# Altium schematic sheet E-17 MIPI DSI_MIPI CSI.SchDoc: FRDM-IMX93
size 513 x 386 mm; DrawnBy: FORLINX; Organization: ORGANIZATION; Address1: ADDRESS 1; Address2: ADDRESS 2; Address3: ADDRESS 3; Address4: ADDRESS 4; Revision: -; ENG_APP_DATE: --/--/--; DSN_APP_DATE: --/--/--; CHK_APP_DATE: --/--/--; Classification: Public, Company Internal/Proprietary, Company Confidential,  Company Secret; Page Create Date: March  8, 1995; OrgName: NXP Semiconductor; FIUO: A; OrgAddr1: NO. 192 Liangjing Rd. Pudong New Area, ShangHai; Page Number: 17; PageTitle: MIPI DSI/MIPI CSI; Page Size: C; Page Count: 23; Designer: FORLINX; RevCode: B1; Approver: NXP SE; Doc: SCH-94611 PDF: SPF-94611; DsnPath: T:\FILES\Designs\Single Board Computers\i.MX93-FRDM\Design Files\SCH-94611_B1.DSN; SchematicName: FRDM-i.MX 93 Development Board; PageName: E-17 MIPI DSI/MIPI CSI; PageSize: C; TopSchematic: True
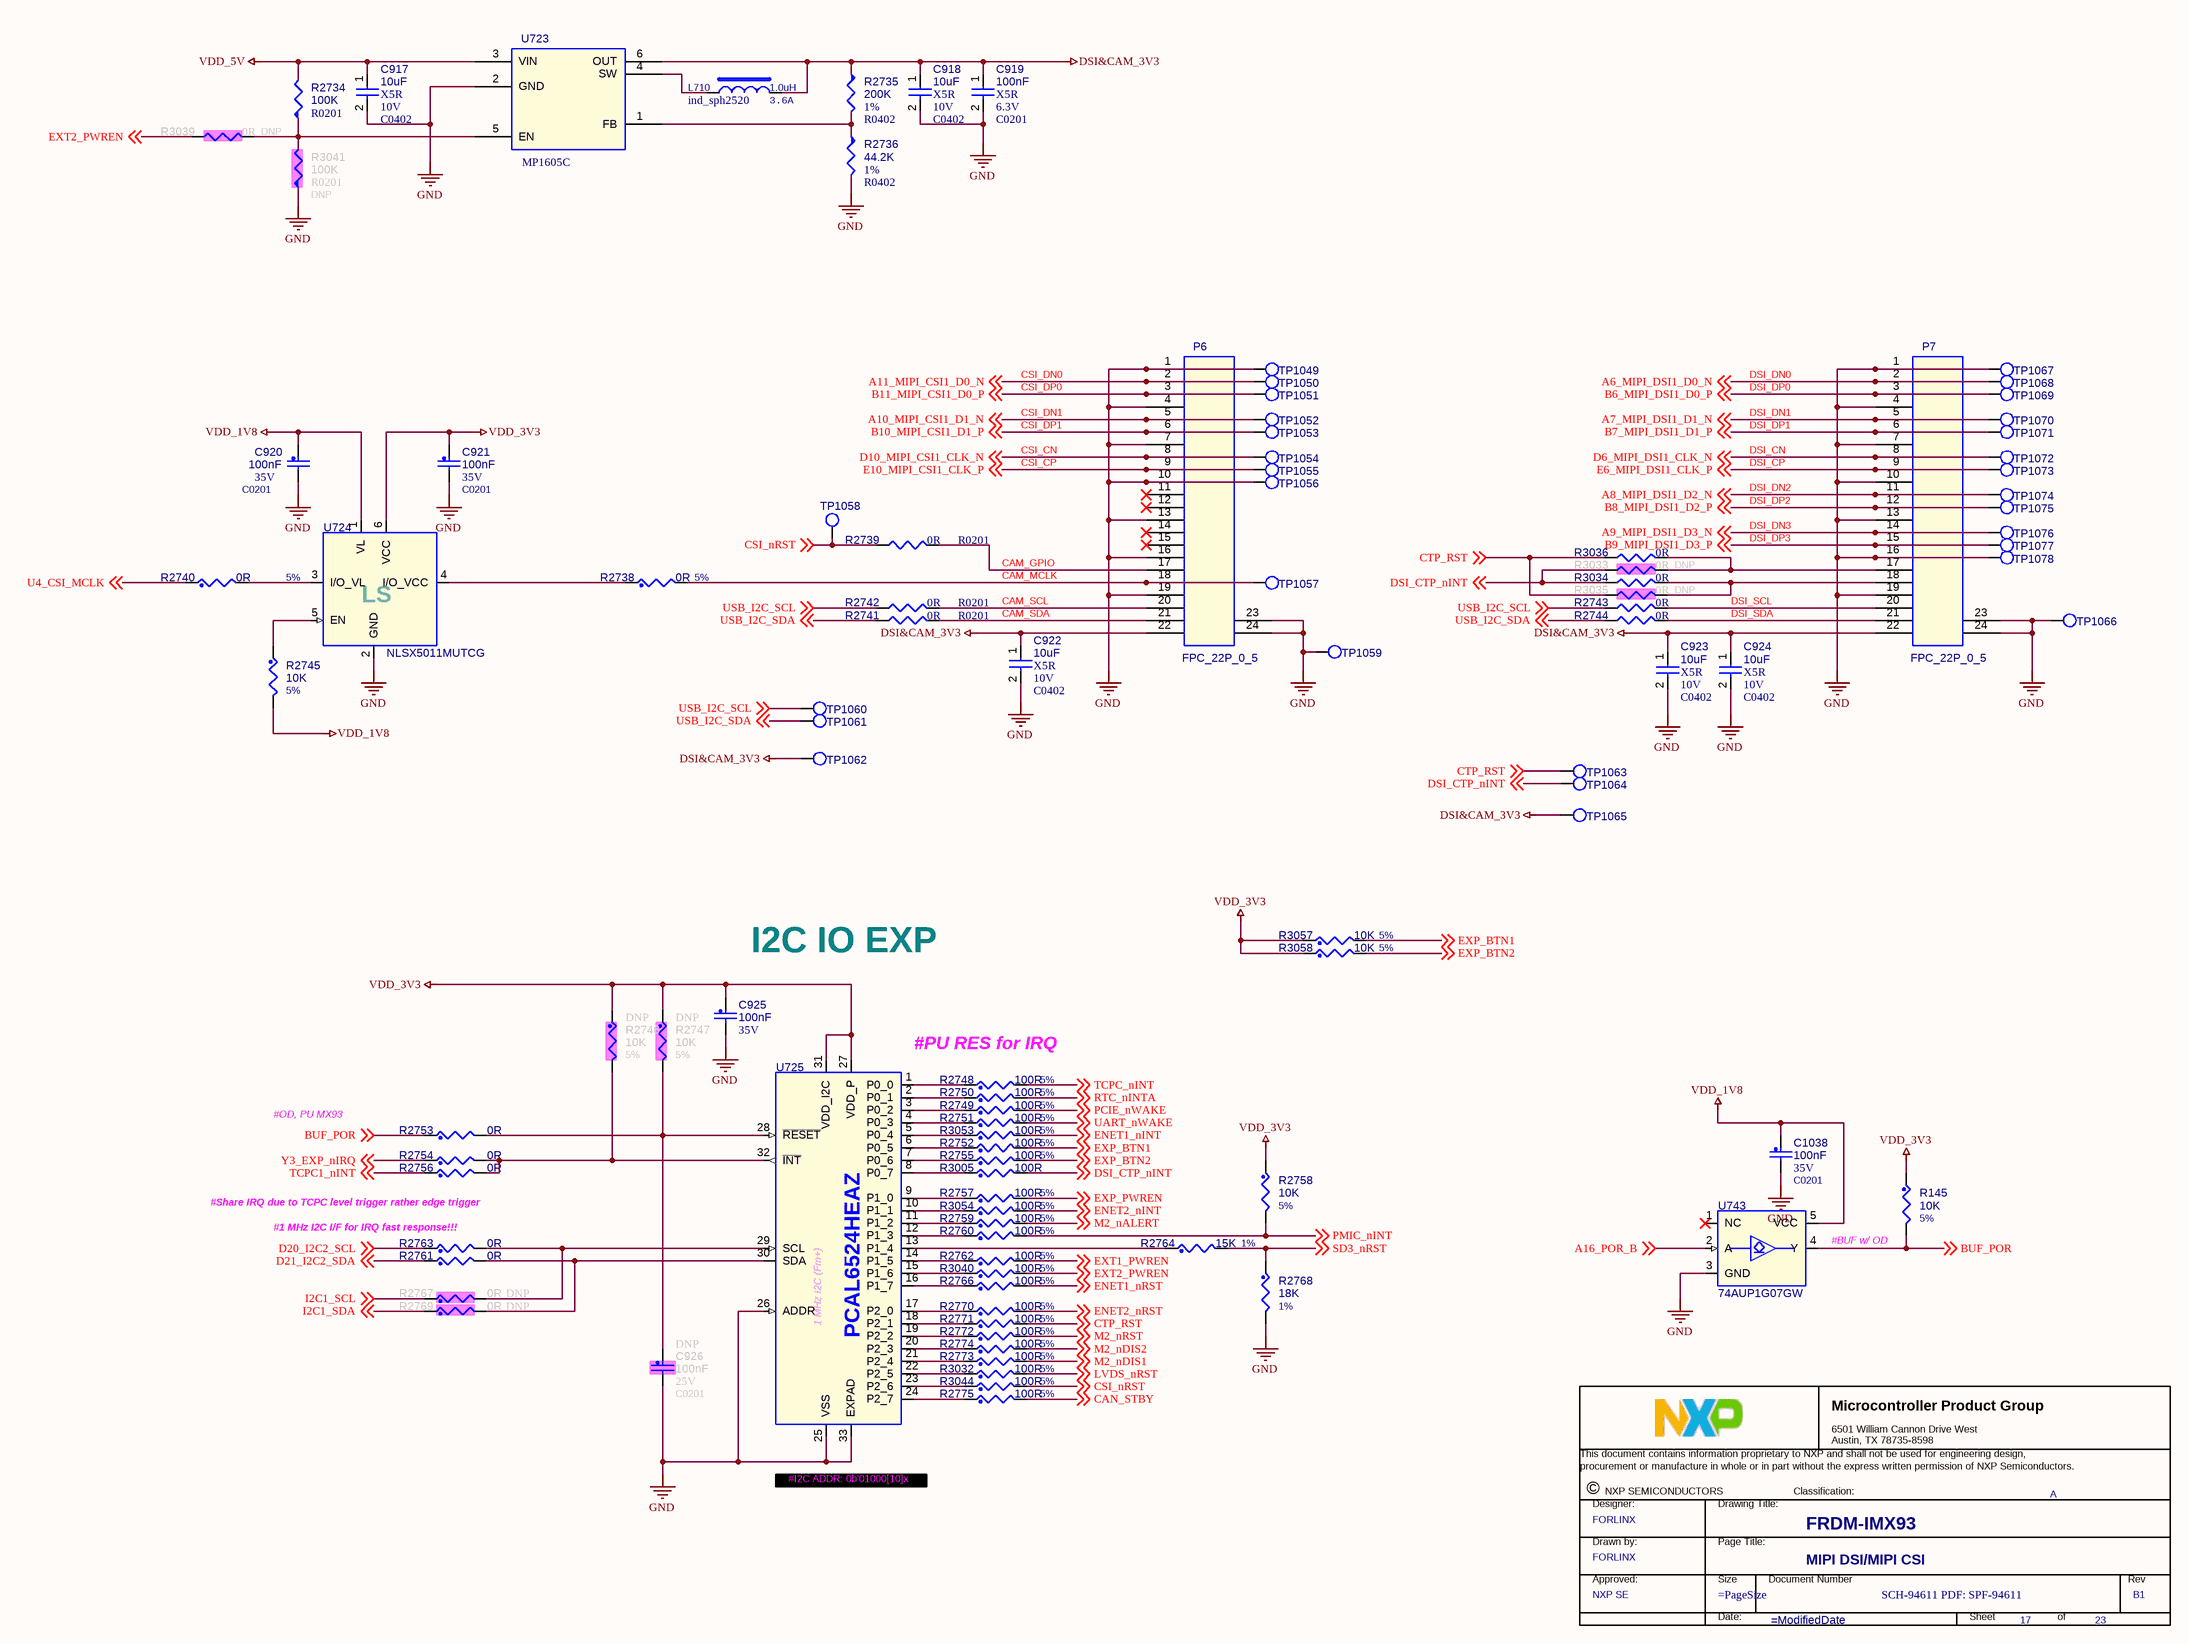
[diagram p0: E-17 MIPI DSI_MIPI CSI.SchDoc]

## Parts
*  Title: FRDM-IMX93  RevCode: B1  PageTitle: MIPI DSI/MIPI CSI  Page Number: 17  Page Count: 23  DrawnBy: FORLINX  Doc: SCH-94611 PDF: SPF-94611  Approver: NXP SE  FIUO: A  (graphical)
C917  10uF  Voltage: 10V  Dielectric: X5R  [C0402]
C918  10uF  Voltage: 10V  Dielectric: X5R  [C0402]
C919  100nF  Voltage: 6.3V  Dielectric: X5R  [C0201]
C920  100nF  VOLTAGE: 35V  [C0201]
C921  100nF  VOLTAGE: 35V  [C0201]
C922  10uF  Voltage: 10V  Dielectric: X5R  [C0402]
C923  10uF  Voltage: 10V  Dielectric: X5R  [C0402]
C924  10uF  Voltage: 10V  Dielectric: X5R  [C0402]
C925  100nF  VOLTAGE: 35V  [C0402]
C926  100nF  ASSY_OPT: DNP  VOLTAGE: 25V  [C0201]
C1038  100nF  VOLTAGE: 35V  [C0201]
L710  1.0uH  Isat: 3.6A  [ind_sph2520]
P6  FPC_22P_0_5  [fpc_22p_0_5]
P7  FPC_22P_0_5  [fpc_22p_0_5]
R145  10K  Tolerance: 5%  [R0201]
R2734  100K  [R0201]
R2735  200K  Tolerance: 1%  [R0402]
R2736  44.2K  Tolerance: 1%  [R0402]
R2738  0R  Tolerance: 5%  [R0201]
R2739  0R  [R0201]
R2740  0R  Tolerance: 5%  [R0201]
R2741  0R  [R0201]
R2742  0R  [R0201]
R2743  0R  [R0201]
R2744  0R  [R0201]
R2745  10K  Tolerance: 5%  [R0201]
R2746  10K  ASSY_OPT: DNP  Tolerance: 5%  [R0201]
R2747  10K  ASSY_OPT: DNP  Tolerance: 5%  [R0201]
R2748  100R  Tolerance: 5%  [R0201]
R2749  100R  Tolerance: 5%  [R0201]
R2750  100R  Tolerance: 5%  [R0201]
R2751  100R  Tolerance: 5%  [R0201]
R2752  100R  Tolerance: 5%  [R0201]
R2753  0R  [R0201]
R2754  0R  [R0201]
R2755  100R  Tolerance: 5%  [R0201]
R2756  0R  [R0201]
R2757  100R  Tolerance: 5%  [R0201]
R2758  10K  Tolerance: 5%  [R0201]
R2759  100R  Tolerance: 5%  [R0201]
R2760  100R  Tolerance: 5%  [R0201]
R2761  0R  [R0201]
R2762  100R  Tolerance: 5%  [R0201]
R2763  0R  [R0201]
R2764  15K  Tolerance: 1%  [R0402]
R2766  100R  Tolerance: 5%  [R0201]
R2767  0R  ASSY_OPT: DNP  [R0201]
R2768  18K  Tolerance: 1%  [R0402]
R2769  0R  ASSY_OPT: DNP  [R0201]
R2770  100R  Tolerance: 5%  [R0201]
R2771  100R  Tolerance: 5%  [R0201]
R2772  100R  Tolerance: 5%  [R0201]
R2773  100R  Tolerance: 5%  [R0201]
R2774  100R  Tolerance: 5%  [R0201]
R2775  100R  Tolerance: 5%  [R0201]
R3005  100R  [R0201]
R3032  100R  Tolerance: 5%  [R0201]
R3033  0R  ASSY_OPT: DNP  [R0201]
R3034  0R  [R0201]
R3035  0R  ASSY_OPT: DNP  [R0201]
R3036  0R  [R0201]
R3039  0R  ASSY_OPT: DNP  [R0201]
R3040  100R  Tolerance: 5%  [R0201]
R3041  100K  ASSY_OPT: DNP  [R0201]
R3044  100R  Tolerance: 5%  [R0201]
R3053  100R  Tolerance: 5%  [R0201]
R3054  100R  Tolerance: 5%  [R0201]
R3057  10K  Tolerance: 5%  [R0201]
R3058  10K  Tolerance: 5%  [R0201]
TP1049  TPAD_020  [tpad_020]  (value not drawn)
TP1050  TPAD_020  [tpad_020]  (value not drawn)
TP1051  TPAD_020  [tpad_020]  (value not drawn)
TP1052  TPAD_020  [tpad_020]  (value not drawn)
TP1053  TPAD_020  [tpad_020]  (value not drawn)
TP1054  TPAD_020  [tpad_020]  (value not drawn)
TP1055  TPAD_020  [tpad_020]  (value not drawn)
TP1056  TPAD_020  [tpad_020]  (value not drawn)
TP1057  TPAD_020  [tpad_020]  (value not drawn)
TP1058  TPAD_020  [tpad_020]  (value not drawn)
TP1059  TPAD_020  [tpad_020]  (value not drawn)
TP1060  TPAD_020  [tpad_020]  (value not drawn)
TP1061  TPAD_020  [tpad_020]  (value not drawn)
TP1062  TPAD_020  [tpad_020]  (value not drawn)
TP1063  TPAD_020  [tpad_020]  (value not drawn)
TP1064  TPAD_020  [tpad_020]  (value not drawn)
TP1065  TPAD_020  [tpad_020]  (value not drawn)
TP1066  TPAD_020  [tpad_020]  (value not drawn)
TP1067  TPAD_020  [tpad_020]  (value not drawn)
TP1068  TPAD_020  [tpad_020]  (value not drawn)
TP1069  TPAD_020  [tpad_020]  (value not drawn)
TP1070  TPAD_020  [tpad_020]  (value not drawn)
TP1071  TPAD_020  [tpad_020]  (value not drawn)
TP1072  TPAD_020  [tpad_020]  (value not drawn)
TP1073  TPAD_020  [tpad_020]  (value not drawn)
TP1074  TPAD_020  [tpad_020]  (value not drawn)
TP1075  TPAD_020  [tpad_020]  (value not drawn)
TP1076  TPAD_020  [tpad_020]  (value not drawn)
TP1077  TPAD_020  [tpad_020]  (value not drawn)
TP1078  TPAD_020  [tpad_020]  (value not drawn)
U723  MP1605C  [SOT563]
U724  NLSX5011MUTCG  [udfn6_0p4_1p2x1]
U725  PCAL6524HEAZ  [uqfn32_0p5_5x5_ep3x3]
U743  74AUP1G07GW  [sc70-5]

## Nets
DSI&CAM_3V3: C918.1 C919.1 C922.1 C923.1 C924.1 L710.2 P6.22 P7.22 R2735.1 TP1062.1(TP) TP1065.1(TP) U723.6(OUT)
GND: C917.2 C918.2 C919.2 C920.2 C921.2 C922.2 C923.2 C924.2 C925.2 C926.2 C1038.2 P6.1 P6.4 P6.7 P6.10 P6.13 P6.16 P6.19 P6.23 P6.24 P7.1 P7.4 P7.7 P7.10 P7.13 P7.16 P7.19 P7.23 P7.24 R2736.2 R2768.2 R3041.1 TP1049.1(TP) TP1056.1(TP) TP1059.1(TP) TP1066.1(TP) TP1067.1(TP) TP1078.1(TP) U723.2(GND) U724.2(GND) U725.25(VSS) U725.26(ADDR) U725.33(EXPAD) U743.3(GND)
VDD_1V8: C920.1 C1038.1 R2745.2 U724.1(VL) U743.5(VCC)
VDD_3V3: C921.1 C925.1 R145.1 R2746.1 R2747.1 R2758.1 R3057.1 R3058.1 U724.6(VCC) U725.27(VDD_P) U725.31(VDD_I2C)
VDD_5V: C917.1 R2734.2 U723.3(VIN)
A16_POR_B: U743.2(A) ; off-sheet A16_POR_B
BUF_POR: R145.2 R2753.1 U743.4(Y) ; off-sheet BUF_POR
CAM_GPIO: P6.17 R2739.2
CAM_MCLK: P6.18 R2738.2 TP1057.1(TP)
CAM_SCL: P6.20 R2742.2
CAM_SDA: P6.21 R2741.2
CAN_STBY: R2775.2 ; off-sheet CAN_STBY
CSI_CN: P6.8 TP1054.1(TP) ; off-sheet D10_MIPI_CSI1_CLK_N  [also labelled D10_MIPI_CSI1_CLK_N]
CSI_CP: P6.9 TP1055.1(TP) ; off-sheet E10_MIPI_CSI1_CLK_P  [also labelled E10_MIPI_CSI1_CLK_P]
CSI_DN0: P6.2 TP1050.1(TP) ; off-sheet A11_MIPI_CSI1_D0_N  [also labelled A11_MIPI_CSI1_D0_N]
CSI_DN1: P6.5 TP1052.1(TP) ; off-sheet A10_MIPI_CSI1_D1_N  [also labelled A10_MIPI_CSI1_D1_N]
CSI_DP0: P6.3 TP1051.1(TP) ; off-sheet B11_MIPI_CSI1_D0_P  [also labelled B11_MIPI_CSI1_D0_P]
CSI_DP1: P6.6 TP1053.1(TP) ; off-sheet B10_MIPI_CSI1_D1_P  [also labelled B10_MIPI_CSI1_D1_P]
CSI_nRST: R2739.1 R3044.2 TP1058.1(TP) ; off-sheet CSI_nRST
CTP_RST: R2771.2 R3035.1 R3036.1 TP1063.1(TP) ; off-sheet CTP_RST
D20_I2C2_SCL: R2763.1 ; off-sheet D20_I2C2_SCL
D21_I2C2_SDA: R2761.1 ; off-sheet D21_I2C2_SDA
DSI_CN: P7.8 TP1072.1(TP) ; off-sheet D6_MIPI_DSI1_CLK_N  [also labelled D6_MIPI_DSI1_CLK_N]
DSI_CP: P7.9 TP1073.1(TP) ; off-sheet E6_MIPI_DSI1_CLK_P  [also labelled E6_MIPI_DSI1_CLK_P]
DSI_CTP_nINT: R3005.2 R3033.1 R3034.1 TP1064.1(TP) ; off-sheet DSI_CTP_nINT
DSI_DN0: P7.2 TP1068.1(TP) ; off-sheet A6_MIPI_DSI1_D0_N  [also labelled A6_MIPI_DSI1_D0_N]
DSI_DN1: P7.5 TP1070.1(TP) ; off-sheet A7_MIPI_DSI1_D1_N  [also labelled A7_MIPI_DSI1_D1_N]
DSI_DN2: P7.11 TP1074.1(TP) ; off-sheet A8_MIPI_DSI1_D2_N  [also labelled A8_MIPI_DSI1_D2_N]
DSI_DN3: P7.14 TP1076.1(TP) ; off-sheet A9_MIPI_DSI1_D3_N  [also labelled A9_MIPI_DSI1_D3_N]
DSI_DP0: P7.3 TP1069.1(TP) ; off-sheet B6_MIPI_DSI1_D0_P  [also labelled B6_MIPI_DSI1_D0_P]
DSI_DP1: P7.6 TP1071.1(TP) ; off-sheet B7_MIPI_DSI1_D1_P  [also labelled B7_MIPI_DSI1_D1_P]
DSI_DP2: P7.12 TP1075.1(TP) ; off-sheet B8_MIPI_DSI1_D2_P  [also labelled B8_MIPI_DSI1_D2_P]
DSI_DP3: P7.15 TP1077.1(TP) ; off-sheet B9_MIPI_DSI1_D3_P  [also labelled B9_MIPI_DSI1_D3_P]
DSI_SCL: P7.20 R2743.2
DSI_SDA: P7.21 R2744.2
ENET1_nINT: R3053.2 ; off-sheet ENET1_nINT
ENET1_nRST: R2766.2 ; off-sheet ENET1_nRST
ENET2_nINT: R3054.2 ; off-sheet ENET2_nINT
ENET2_nRST: R2770.2 ; off-sheet ENET2_nRST
EXP_BTN1: R2752.2 R3057.2 ; off-sheet EXP_BTN1
EXP_BTN2: R2755.2 R3058.2 ; off-sheet EXP_BTN2
EXP_PWREN: R2757.2 ; off-sheet EXP_PWREN
EXT1_PWREN: R2762.2 ; off-sheet EXT1_PWREN
EXT2_PWREN: R3039.1 R3040.2 ; off-sheet EXT2_PWREN
I2C1_SCL: R2767.1 ; off-sheet I2C1_SCL
I2C1_SDA: R2769.1 ; off-sheet I2C1_SDA
LVDS_nRST: R3032.2 ; off-sheet LVDS_nRST
M2_nALERT: R2759.2 ; off-sheet M2_nALERT
M2_nDIS1: R2773.2 ; off-sheet M2_nDIS1
M2_nDIS2: R2774.2 ; off-sheet M2_nDIS2
M2_nRST: R2772.2 ; off-sheet M2_nRST
PCIE_nWAKE: R2749.2 ; off-sheet PCIE_nWAKE
PMIC_nINT: R2758.2 R2760.2 ; off-sheet PMIC_nINT
RTC_nINTA: R2750.2 ; off-sheet RTC_nINTA
SD3_nRST: R2764.2 R2768.1 ; off-sheet SD3_nRST
TCPC1_nINT: R2756.1 ; off-sheet TCPC1_nINT
TCPC_nINT: R2748.2 ; off-sheet TCPC_nINT
U4_CSI_MCLK: R2740.1 ; off-sheet U4_CSI_MCLK
UART_nWAKE: R2751.2 ; off-sheet UART_nWAKE
USB_I2C_SCL: R2742.1 R2743.1 TP1060.1(TP) ; off-sheet USB_I2C_SCL
USB_I2C_SDA: R2741.1 R2744.1 TP1061.1(TP) ; off-sheet USB_I2C_SDA
Y3_EXP_nIRQ: R2754.1 ; off-sheet Y3_EXP_nIRQ
NetC926_1: C926.1 R2747.2 R2753.2 U725.28(~{RESET})
NetL710_1: L710.1 U723.4(SW)
NetP7_17: P7.17 R3033.2 R3036.2
NetP7_18: P7.18 R3034.2 R3035.2
NetR2734_1: R2734.1 R3039.2 R3041.2 U723.5(EN)
NetR2735_2: R2735.2 R2736.1 U723.1(FB)
NetR2738_1: R2738.1 U724.4(I/O_VCC)
NetR2740_2: R2740.2 U724.3(I/O_VL)
NetR2745_1: R2745.1 U724.5(EN)
NetR2746_2: R2746.2 R2754.2 R2756.2 U725.32(~{INT})
NetR2748_1: R2748.1 U725.1(P0_0)
NetR2749_1: R2749.1 U725.3(P0_2)
NetR2750_1: R2750.1 U725.2(P0_1)
NetR2751_1: R2751.1 U725.4(P0_3)
NetR2752_1: R2752.1 U725.6(P0_5)
NetR2755_1: R2755.1 U725.7(P0_6)
NetR2757_1: R2757.1 U725.9(P1_0)
NetR2759_1: R2759.1 U725.11(P1_2)
NetR2760_1: R2760.1 U725.12(P1_3)
NetR2761_2: R2761.2 R2769.2 U725.30(SDA)
NetR2762_1: R2762.1 U725.14(P1_5)
NetR2763_2: R2763.2 R2767.2 U725.29(SCL)
NetR2764_1: R2764.1 U725.13(P1_4)
NetR2766_1: R2766.1 U725.16(P1_7)
NetR2770_1: R2770.1 U725.17(P2_0)
NetR2771_1: R2771.1 U725.18(P2_1)
NetR2772_1: R2772.1 U725.19(P2_2)
NetR2773_1: R2773.1 U725.21(P2_4)
NetR2774_1: R2774.1 U725.20(P2_3)
NetR2775_1: R2775.1 U725.24(P2_7)
NetR3005_1: R3005.1 U725.8(P0_7)
NetR3032_1: R3032.1 U725.22(P2_5)
NetR3040_1: R3040.1 U725.15(P1_6)
NetR3044_1: R3044.1 U725.23(P2_6)
NetR3053_1: R3053.1 U725.5(P0_4)
NetR3054_1: R3054.1 U725.10(P1_1)

Not connected (* = marked no-connect by the designer): P6 11* 12* 14* 15*; U743 1(NC)*

## Notes on the sheet
- (near U724) LS
- I2C IO EXP
- #PU RES for IRQ
- #OD, PU MX93
- #Share IRQ due to TCPC level trigger rather edge trigger
- (near R2763) #1 MHz I2C I/F for IRQ fast response!!!
- #BUF w/ OD
- (near U725) 1 MHz I2C (Fm+)
- #I2C ADDR: 0b'01000[10]x
- DWG. NO.
- REV.
- SHT.
- REVISION
- DESCRIPTION
- DATE
- APPROVED
- ENG:
- APPROVALS
- quilter.ai <http://quilter.ai>
- DSN:
- CHK:
- REFERENCE DOCUMENTS
- TITLE
- PROJECT
- BOM:
- FAB DWG:
- PCB DWG:
- ASSY DWG:
- SIZE
- FILE NAME
- C
- DWG NO.
- SHEET
- OF
- REV
- (in symbol TitleBlock_MCPG) Microcontroller Product Group; 6501 William Cannon Drive West / Austin, TX 78735-8598; This document contains information proprietary to NXP and shall not be used for engineering design,; procurement or manufacture in whole or in part without the express written permission of NXP Semiconductors.; ©; NXP SEMICONDUCTORS; Classification:; Designer:; Drawing Title:; Drawn by:; Page Title:; Approved:; Size; Document Number; Rev; Date:; Sheet; of

## Library data of the parts
* = TitleBlock_MCPG: Classification: Public, Company Internal/Proprietary, Company Confidential,  Company Secret; OrgAddr1: NO. 192 Liangjing Rd. Pudong New Area, ShangHai; OrgName: NXP Semiconductor; Page Size: =PageSize; Page Create Date: March  8, 1995; Designer: FORLINX; Page Modify Date: =ModifiedDate
C917 = CAP NP: 0402,10uF,6.3V,+/-20%,X5R; Part Reference: C917; Manufacturer: murata; Manufacturer PN: GRM188R61A106MAAL; MFG_PN01: 0402X106M6R3NT; RK PN: 902003487; Priority: A; Tolerance: ¡À20%; MFG_NAME01: FENGHUA; PCB Footprint: C0402; Value: 10uF; Part Type: Ò»°ãÓÃÆ¬×´ÌÕ´ÉµçÈÝ; C_Voltage: 6.3V; Created by: JJJ
C918 = CAP NP: 0402,10uF,6.3V,+/-20%,X5R; Part Reference: C918; Manufacturer PN: C2012X5R1A226K125AB; Manufacturer: TDK; MFG_PN01: 0402X106M6R3NT; Tolerance: 10%; Priority: A; MFG_NAME01: FENGHUA; PCB Footprint: C0402; Value: 10uF; Created by: JJJ; C_Voltage: 6.3V; Part Type: C0805; RK PN: C2012X5R1A226K125AB
C919 = CAP NP: 0201,100nF,25V,+/-10%,X5R; Part Reference: C919; Manufacturer PN: 0402X104K6R3NT; Manufacturer: FH(·ç»ª); MFG_PN01: 0201X104K250NT; Tolerance: ¡À10%; Priority: A; RK PN: 902004347; MFG_NAME01: FENGHUA; PCB Footprint: C0201; Value: 100nF; Created by: JJJ; Part Type: Ò»°ãÓÃÆ¬×´ÌÕ´ÉµçÈÝ
C920 = CAP_NP: 0201,100nF,25V,+/-10%,X5R; Part Reference: C920; CLASS: DISCRETE; FPLIST: CC0402_25,CC0402_HD,0402_CC,capc0402_l; CAD_APPROVED: Yes; MFG_PN01: 0201X104K250NT; MFG_NAME01: FENGHUA; Tolerance: 10%; Value: 100nF; PCB Footprint: C0201; HEIGHT: 0.55MM; ROHS: Yes
C921 = CAP_NP: 0201,100nF,25V,+/-10%,X5R; Part Reference: C921; CLASS: DISCRETE; Tolerance: 10%; MFG_NAME01: FENGHUA; MFG_PN01: 0201X104K250NT; CAD_APPROVED: Yes; FPLIST: CC0402_25,CC0402_HD,0402_CC,capc0402_l; Value: 100nF; PCB Footprint: C0201; ROHS: Yes; HEIGHT: 0.55MM
C922 = CAP NP: 0402,10uF,6.3V,+/-20%,X5R; Part Reference: C922; Manufacturer PN: C2012X5R1A226K125AB; Manufacturer: TDK; MFG_PN01: 0402X106M6R3NT; Tolerance: 10%; Priority: A; MFG_NAME01: FENGHUA; PCB Footprint: C0402; Value: 10uF; Created by: JJJ; C_Voltage: 6.3V; Part Type: C0805; RK PN: C2012X5R1A226K125AB
C923 = CAP NP: 0402,10uF,6.3V,+/-20%,X5R; Part Reference: C923; Manufacturer PN: C2012X5R1A226K125AB; Manufacturer: TDK; MFG_PN01: 0402X106M6R3NT; Tolerance: 10%; Priority: A; MFG_NAME01: FENGHUA; PCB Footprint: C0402; Value: 10uF; Created by: JJJ; C_Voltage: 6.3V; Part Type: C0805; RK PN: C2012X5R1A226K125AB
C924 = CAP NP: 0402,10uF,6.3V,+/-20%,X5R; Part Reference: C924; Manufacturer: TDK; MFG_PN01: 0402X106M6R3NT; RK PN: C2012X5R1A226K125AB; Priority: A; Tolerance: 10%; MFG_NAME01: FENGHUA; PCB Footprint: C0402; Value: 10uF; Part Type: C0805; C_Voltage: 6.3V; Manufacturer PN: C2012X5R1A226K125AB; Created by: JJJ
C925 = CAP_NP: 0402,100nF,50V,+/-10%,X5R; Part Reference: C925; CLASS: DISCRETE; Tolerance: 10%; MFG_NAME01: FENGHUA; MFG_PN01: 0402X104K500NT; CAD_APPROVED: Yes; FPLIST: CC0402_25,CC0402_HD,0402_CC,capc0402_l; Value: 100nF; PCB Footprint: C0402; ROHS: Yes; HEIGHT: 0.55MM
C926 = CAP_NP: 0201,100nF,25V,+/-10%,X5R; Part Reference: C926; CLASS: DISCRETE; Tolerance: 10%; MFG_NAME01: FENGHUA; MFG_PN01: 0201X104K250NT; CAD_APPROVED: Yes; FPLIST: CC0402_25,CC0402_HD,0402_CC,capc0402_l; Value: 100nF; PCB Footprint: C0201; ROHS: Yes; HEIGHT: 0.55MM
C1038 = CAP_NP: 0201,100nF,25V,+/-10%,X5R; Part Reference: C1038; CLASS: DISCRETE; Tolerance: 10%; MFG_NAME01: FENGHUA; MFG_PN01: 0201X104K250NT; CAD_APPROVED: Yes; FPLIST: CC0402_25,CC0402_HD,0402_CC,capc0402_l; Value: 100nF; PCB Footprint: C0201; ROHS: Yes; HEIGHT: 0.55MM
L710 = INDUCTORS OF FERRITE: 1uH ,2.5*2.0*1.2mm, 3.6A; Part Reference: L710; Manufacturer PN: VLS252010HBX-1R0M; Manufacturer: TDK; DC Resistor: 0.065ohm; MFG_PN01: WPN252012H1R0MT; Resonace frequency: 1MHz; Irms: 2.55A; Tolerance: 20%; Priority: A; MFG_NAME01: Sunlord; PCB Footprint: ind_sph2520; Value: 1.0uH; Created by: JJJ; Part Type: IND; RK PN: VLS252010HBX-1R0M
P6 = FPC_22P_0_5: 22P,0.5mm,A; Part Reference: P6; MFG_PN01: 22P-0.5mm-A; MFG_NAME01: SHENGWEI; Value: FPC_22P_0_5; PCB Footprint: fpc_22p_0_5
P7 = FPC_22P_0_5: 22P,0.5mm,A; Part Reference: P7; MFG_PN01: 22P-0.5mm-A; MFG_NAME01: SHENGWEI; Value: FPC_22P_0_5; PCB Footprint: fpc_22p_0_5
R145 = RES: 0201,10K,+/-5%; Part Reference: R145; CLASS: DISCRETE; MFG_NAME01: FENGHUA; MFG_PN01: RC-01W103JT; CAD_APPROVED: Yes; FPLIST: RC0402_25,RC0402_HD,0402_CC; Value: 10K; PCB Footprint: R0201; ROHS: Yes; HEIGHT: 0.4 MM
R2734 = RESISTOR5: 0201,100K,+/-1%; Part Reference: R2734; Manufacturer PN: RC0402JR-07100KL; Manufacturer: YAGEO; Tolerance: 5%; MFG_PN01: RC-01W1003FT; Wattage: 1/16W; Priority: A; RK PN: 901001447; MFG_NAME01: FENGHUA; PCB Footprint: R0201; Value: 100K; Created by: YTL; Part Type: Í¨ÓÃºñÄ¤µç×è
R2735 = RESISTOR1: 0402,200K,+/-1%; Part Reference: R2735; Manufacturer: YAGEO; Manufacturer PN: RC0402FR-07249KL; MFG_PN01: RC-02K2003FT; RK PN: 901000996; Priority: A; Wattage: 1/16W; MFG_NAME01: FENGHUA; PCB Footprint: R0402; Value: 200K; Part Type: Í¨ÓÃºñÄ¤µç×è; Created by: YTL
R2736 = RESISTOR1: 0402,44.2K,+/-1%; Part Reference: R2736; Manufacturer PN: RC0402FR-07249KL; Manufacturer: YAGEO; MFG_PN01: RC-02K4422FT; Wattage: 1/16W; Priority: A; RK PN: 901000996; MFG_NAME01: FENGHUA; PCB Footprint: R0402; Value: 44.2K; Created by: YTL; Part Type: Í¨ÓÃºñÄ¤µç×è
R2738 = RES: 0201,0Ohm,+/-5%; Part Reference: R2738; CLASS: DISCRETE; VOLTAGE: 1/16W; FPLIST: RC0402_25,RC0402_HD,RC0402_X2,0402_CC; CAD_APPROVED: Yes; MFG_PN01: RC-01000JT; MFG_NAME01: FENGHUA; Value: 0R; PCB Footprint: R0201; HEIGHT: 0.45 MM; ROHS: Yes
R2739 = R0402,4.7K_Dup1: 0201,0Ohm,+/-5%; Part Reference: R2739; precision: ¡À1£¥; serial number: 1110102015; MFG_PN01: RC-01000JT; MFG_NAME01: FENGHUA; PCB Footprint: R0201; Value: 0R
R2740 = RES: 0201,0Ohm,+/-5%; Part Reference: R2740; CLASS: DISCRETE; VOLTAGE: 1/16W; FPLIST: RC0402_25,RC0402_HD,RC0402_X2,0402_CC; CAD_APPROVED: Yes; MFG_PN01: RC-01000JT; MFG_NAME01: FENGHUA; Value: 0R; PCB Footprint: R0201; HEIGHT: 0.45 MM; ROHS: Yes
R2741 = R0402,4.7K_Dup1: 0201,0Ohm,+/-5%; Part Reference: R2741; precision: ¡À1£¥; serial number: 1110102015; MFG_PN01: RC-01000JT; MFG_NAME01: FENGHUA; PCB Footprint: R0201; Value: 0R
R2742 = R0402,4.7K_Dup1: 0201,0Ohm,+/-5%; Part Reference: R2742; precision: ¡À1£¥; serial number: 1110102015; MFG_PN01: RC-01000JT; MFG_NAME01: FENGHUA; PCB Footprint: R0201; Value: 0R
R2743 = R0402,4.7K_Dup1: 0201,0Ohm,+/-5%; Part Reference: R2743; precision: ¡À1£¥; serial number: 1110102015; MFG_PN01: RC-01000JT; MFG_NAME01: FENGHUA; PCB Footprint: R0201; Value: 0R
R2744 = R0402,4.7K_Dup1: 0201,0Ohm,+/-5%; Part Reference: R2744; precision: ¡À1£¥; serial number: 1110102015; MFG_PN01: RC-01000JT; MFG_NAME01: FENGHUA; PCB Footprint: R0201; Value: 0R
R2745 = RES: 0201,10K,+/-5%; Part Reference: R2745; CLASS: DISCRETE; MFG_NAME01: FENGHUA; MFG_PN01: RC-01W103JT; CAD_APPROVED: Yes; FPLIST: RC0402_25,RC0402_HD,0402_CC; Value: 10K; PCB Footprint: R0201; ROHS: Yes; HEIGHT: 0.4 MM
R2746 = RES: 0201,10K,+/-5%; Part Reference: R2746; CLASS: DISCRETE; FPLIST: RC0402_25,RC0402_HD,0402_CC; CAD_APPROVED: Yes; MFG_PN01: RC-01W103JT; MFG_NAME01: FENGHUA; Value: 10K; PCB Footprint: R0201; HEIGHT: 0.4 MM; ROHS: Yes
R2747 = RES: 0201,10K,+/-5%; Part Reference: R2747; CLASS: DISCRETE; MFG_NAME01: FENGHUA; MFG_PN01: RC-01W103JT; CAD_APPROVED: Yes; FPLIST: RC0402_25,RC0402_HD,0402_CC; Value: 10K; PCB Footprint: R0201; ROHS: Yes; HEIGHT: 0.4 MM
R2748 = RES: 0201,100Ohm,+/-1%; Part Reference: R2748; CLASS: DISCRETE; FPLIST: RC0402_25,RC0402_HD,RC0402_X2,0402_CC; CAD_APPROVED: Yes; Temp Range: -55¡ãC to +175¡ãC; MFG_NAME01: FENGHUA; MFG_PN01: RC-01W1000FT; Value: 100R; PCB Footprint: R0201; HEIGHT: 0.45MM; ROHS: Yes
R2749 = RES: 0201,100Ohm,+/-1%; Part Reference: R2749; CLASS: DISCRETE; MFG_PN01: RC-01W1000FT; MFG_NAME01: FENGHUA; Temp Range: -55¡ãC to +175¡ãC; CAD_APPROVED: Yes; FPLIST: RC0402_25,RC0402_HD,RC0402_X2,0402_CC; Value: 100R; PCB Footprint: R0201; ROHS: Yes; HEIGHT: 0.45MM
R2750 = RES: 0201,100Ohm,+/-1%; Part Reference: R2750; CLASS: DISCRETE; MFG_PN01: RC-01W1000FT; MFG_NAME01: FENGHUA; Temp Range: -55¡ãC to +175¡ãC; CAD_APPROVED: Yes; FPLIST: RC0402_25,RC0402_HD,RC0402_X2,0402_CC; Value: 100R; PCB Footprint: R0201; ROHS: Yes; HEIGHT: 0.45MM
R2751 = RES: 0201,100Ohm,+/-1%; Part Reference: R2751; CLASS: DISCRETE; MFG_PN01: RC-01W1000FT; MFG_NAME01: FENGHUA; Temp Range: -55¡ãC to +175¡ãC; CAD_APPROVED: Yes; FPLIST: RC0402_25,RC0402_HD,RC0402_X2,0402_CC; Value: 100R; PCB Footprint: R0201; ROHS: Yes; HEIGHT: 0.45MM
R2752 = RES: 0201,100Ohm,+/-1%; Part Reference: R2752; CLASS: DISCRETE; MFG_PN01: RC-01W1000FT; MFG_NAME01: FENGHUA; Temp Range: -55¡ãC to +175¡ãC; CAD_APPROVED: Yes; FPLIST: RC0402_25,RC0402_HD,RC0402_X2,0402_CC; Value: 100R; PCB Footprint: R0201; ROHS: Yes; HEIGHT: 0.45MM
R2753 = RES: 0201,0Ohm,+/-5%; Part Reference: R2753; CLASS: DISCRETE; VOLTAGE: 1/16W; Tolerance: 5%; MFG_NAME01: FENGHUA; MFG_PN01: RC-01000JT; CAD_APPROVED: Yes; FPLIST: RC0402_25,RC0402_HD,RC0402_X2,0402_CC; Value: 0R; PCB Footprint: R0201; HEIGHT: 0.45 MM; ROHS: Yes
R2754 = RES: 0201,0Ohm,+/-5%; Part Reference: R2754; CLASS: DISCRETE; FPLIST: RC0402_25,RC0402_HD,RC0402_X2,0402_CC; CAD_APPROVED: Yes; MFG_PN01: RC-01000JT; MFG_NAME01: FENGHUA; Tolerance: 5%; VOLTAGE: 1/16W; Value: 0R; PCB Footprint: R0201; ROHS: Yes; HEIGHT: 0.45 MM
R2755 = RES: 0201,100Ohm,+/-1%; Part Reference: R2755; CLASS: DISCRETE; MFG_PN01: RC-01W1000FT; MFG_NAME01: FENGHUA; Temp Range: -55¡ãC to +175¡ãC; CAD_APPROVED: Yes; FPLIST: RC0402_25,RC0402_HD,RC0402_X2,0402_CC; Value: 100R; PCB Footprint: R0201; ROHS: Yes; HEIGHT: 0.45MM
R2756 = RES: 0201,0Ohm,+/-5%; Part Reference: R2756; CLASS: DISCRETE; VOLTAGE: 1/16W; Tolerance: 5%; MFG_NAME01: FENGHUA; MFG_PN01: RC-01000JT; CAD_APPROVED: Yes; FPLIST: RC0402_25,RC0402_HD,RC0402_X2,0402_CC; Value: 0R; PCB Footprint: R0201; HEIGHT: 0.45 MM; ROHS: Yes
R2757 = RES: 0201,100Ohm,+/-1%; Part Reference: R2757; CLASS: DISCRETE; MFG_PN01: RC-01W1000FT; MFG_NAME01: FENGHUA; Temp Range: -55¡ãC to +175¡ãC; CAD_APPROVED: Yes; FPLIST: RC0402_25,RC0402_HD,RC0402_X2,0402_CC; Value: 100R; PCB Footprint: R0201; ROHS: Yes; HEIGHT: 0.45MM
R2758 = RES: 0201,10K,+/-5%; Part Reference: R2758; CLASS: DISCRETE; MFG_NAME01: FENGHUA; MFG_PN01: RC-01W103JT; CAD_APPROVED: Yes; FPLIST: RC0402_25,RC0402_HD,0402_CC; Value: 10K; PCB Footprint: R0201; ROHS: Yes; HEIGHT: 0.4 MM
R2759 = RES: 0201,100Ohm,+/-1%; Part Reference: R2759; CLASS: DISCRETE; MFG_PN01: RC-01W1000FT; MFG_NAME01: FENGHUA; Temp Range: -55¡ãC to +175¡ãC; CAD_APPROVED: Yes; FPLIST: RC0402_25,RC0402_HD,RC0402_X2,0402_CC; Value: 100R; PCB Footprint: R0201; ROHS: Yes; HEIGHT: 0.45MM
R2760 = RES: 0201,100Ohm,+/-1%; Part Reference: R2760; CLASS: DISCRETE; FPLIST: RC0402_25,RC0402_HD,RC0402_X2,0402_CC; CAD_APPROVED: Yes; Temp Range: -55¡ãC to +175¡ãC; MFG_NAME01: FENGHUA; MFG_PN01: RC-01W1000FT; Value: 100R; PCB Footprint: R0201; HEIGHT: 0.45MM; ROHS: Yes
R2761 = RES: 0201,0Ohm,+/-5%; Part Reference: R2761; CLASS: DISCRETE; FPLIST: RC0402_25,RC0402_HD,RC0402_X2,0402_CC; CAD_APPROVED: Yes; MFG_PN01: RC-01000JT; MFG_NAME01: FENGHUA; Tolerance: 5%; VOLTAGE: 1/16W; Value: 0R; PCB Footprint: R0201; ROHS: Yes; HEIGHT: 0.45 MM
R2762 = RES: 0201,100Ohm,+/-1%; Part Reference: R2762; CLASS: DISCRETE; FPLIST: RC0402_25,RC0402_HD,RC0402_X2,0402_CC; CAD_APPROVED: Yes; Temp Range: -55¡ãC to +175¡ãC; MFG_NAME01: FENGHUA; MFG_PN01: RC-01W1000FT; Value: 100R; PCB Footprint: R0201; HEIGHT: 0.45MM; ROHS: Yes
R2763 = RES: 0201,0Ohm,+/-5%; Part Reference: R2763; CLASS: DISCRETE; FPLIST: RC0402_25,RC0402_HD,RC0402_X2,0402_CC; CAD_APPROVED: Yes; MFG_PN01: RC-01000JT; MFG_NAME01: FENGHUA; Tolerance: 5%; VOLTAGE: 1/16W; Value: 0R; PCB Footprint: R0201; ROHS: Yes; HEIGHT: 0.45 MM
R2764 = RES: 0402,15K,+/-1%; Part Reference: R2764; CLASS: DISCRETE; MFG_PN01: RC-02W1502FT; MFG_NAME01: FENGHUA; CAD_APPROVED: Yes; FPLIST: RC0402_25,RC0402_HD,0402_CC; Value: 15K; PCB Footprint: R0402; ROHS: Yes; HEIGHT: 0.4 MM
R2766 = RES: 0201,100Ohm,+/-1%; Part Reference: R2766; CLASS: DISCRETE; MFG_PN01: RC-01W1000FT; MFG_NAME01: FENGHUA; Temp Range: -55¡ãC to +175¡ãC; CAD_APPROVED: Yes; FPLIST: RC0402_25,RC0402_HD,RC0402_X2,0402_CC; Value: 100R; PCB Footprint: R0201; ROHS: Yes; HEIGHT: 0.45MM
R2767 = RES: 0201,0Ohm,+/-5%; Part Reference: R2767; CLASS: DISCRETE; FPLIST: RC0402_25,RC0402_HD,RC0402_X2,0402_CC; CAD_APPROVED: Yes; MFG_PN01: RC-01000JT; MFG_NAME01: FENGHUA; Tolerance: 5%; VOLTAGE: 1/16W; Value: 0R; PCB Footprint: R0201; ROHS: Yes; HEIGHT: 0.45 MM
R2768 = RES: 0402,18K,+/-1%; Part Reference: R2768; CLASS: DISCRETE; MFG_PN01: RC-02W1802FT; MFG_NAME01: FENGHUA; Temp Range: -55¡ãC to +155¡ãC; VOLTAGE: 50V; CAD_APPROVED: Yes; FPLIST: RC0402_25,RC0402_HD,0402_CC; Value: 18K; PCB Footprint: R0402; ROHS: Yes; HEIGHT: 0.4MM
R2769 = RES: 0201,0Ohm,+/-5%; Part Reference: R2769; CLASS: DISCRETE; VOLTAGE: 1/16W; Tolerance: 5%; MFG_NAME01: FENGHUA; MFG_PN01: RC-01000JT; CAD_APPROVED: Yes; FPLIST: RC0402_25,RC0402_HD,RC0402_X2,0402_CC; Value: 0R; PCB Footprint: R0201; HEIGHT: 0.45 MM; ROHS: Yes
R2770 = RES: 0201,100Ohm,+/-1%; Part Reference: R2770; CLASS: DISCRETE; MFG_PN01: RC-01W1000FT; MFG_NAME01: FENGHUA; Temp Range: -55¡ãC to +175¡ãC; CAD_APPROVED: Yes; FPLIST: RC0402_25,RC0402_HD,RC0402_X2,0402_CC; Value: 100R; PCB Footprint: R0201; ROHS: Yes; HEIGHT: 0.45MM
R2771 = RES: 0201,100Ohm,+/-1%; Part Reference: R2771; CLASS: DISCRETE; MFG_PN01: RC-01W1000FT; MFG_NAME01: FENGHUA; Temp Range: -55¡ãC to +175¡ãC; CAD_APPROVED: Yes; FPLIST: RC0402_25,RC0402_HD,RC0402_X2,0402_CC; Value: 100R; PCB Footprint: R0201; ROHS: Yes; HEIGHT: 0.45MM
R2772 = RES: 0201,100Ohm,+/-1%; Part Reference: R2772; CLASS: DISCRETE; FPLIST: RC0402_25,RC0402_HD,RC0402_X2,0402_CC; CAD_APPROVED: Yes; Temp Range: -55¡ãC to +175¡ãC; MFG_NAME01: FENGHUA; MFG_PN01: RC-01W1000FT; Value: 100R; PCB Footprint: R0201; HEIGHT: 0.45MM; ROHS: Yes
R2773 = RES: 0201,100Ohm,+/-1%; Part Reference: R2773; CLASS: DISCRETE; FPLIST: RC0402_25,RC0402_HD,RC0402_X2,0402_CC; CAD_APPROVED: Yes; Temp Range: -55¡ãC to +175¡ãC; MFG_NAME01: FENGHUA; MFG_PN01: RC-01W1000FT; Value: 100R; PCB Footprint: R0201; HEIGHT: 0.45MM; ROHS: Yes
R2774 = RES: 0201,100Ohm,+/-1%; Part Reference: R2774; CLASS: DISCRETE; FPLIST: RC0402_25,RC0402_HD,RC0402_X2,0402_CC; CAD_APPROVED: Yes; Temp Range: -55¡ãC to +175¡ãC; MFG_NAME01: FENGHUA; MFG_PN01: RC-01W1000FT; Value: 100R; PCB Footprint: R0201; HEIGHT: 0.45MM; ROHS: Yes
R2775 = RES: 0201,100Ohm,+/-1%; Part Reference: R2775; CLASS: DISCRETE; FPLIST: RC0402_25,RC0402_HD,RC0402_X2,0402_CC; CAD_APPROVED: Yes; Temp Range: -55¡ãC to +175¡ãC; MFG_NAME01: FENGHUA; MFG_PN01: RC-01W1000FT; Value: 100R; PCB Footprint: R0201; HEIGHT: 0.45MM; ROHS: Yes
R3005 = RES: 0201,100Ohm,+/-1%; Part Reference: R3005; CLASS: DISCRETE; FPLIST: RC0402_25,RC0402_HD,RC0402_X2,0402_CC; Tolerance: 5%; CAD_APPROVED: Yes; Temp Range: -55¡ãC to +175¡ãC; MFG_NAME01: FENGHUA; MFG_PN01: RC-01W1000FT; Value: 100R; PCB Footprint: R0201; HEIGHT: 0.45MM; ROHS: Yes
R3032 = RES: 0201,100Ohm,+/-1%; Part Reference: R3032; CLASS: DISCRETE; FPLIST: RC0402_25,RC0402_HD,RC0402_X2,0402_CC; CAD_APPROVED: Yes; Temp Range: -55¡ãC to +175¡ãC; MFG_NAME01: FENGHUA; MFG_PN01: RC-01W1000FT; Value: 100R; PCB Footprint: R0201; HEIGHT: 0.45MM; ROHS: Yes
R3033 = R0402,4.7K_Dup1: 0201,0Ohm,+/-5%; Part Reference: R3033; precision: ¡À1£¥; serial number: 1110102015; MFG_PN01: RC-01000JT; MFG_NAME01: FENGHUA; PCB Footprint: R0201; Value: 0R
R3034 = R0402,4.7K_Dup1: 0201,0Ohm,+/-5%; Part Reference: R3034; precision: ¡À1£¥; serial number: 1110102015; MFG_PN01: RC-01000JT; MFG_NAME01: FENGHUA; PCB Footprint: R0201; Value: 0R
R3035 = R0402,4.7K_Dup1: 0201,0Ohm,+/-5%; Part Reference: R3035; precision: ¡À1£¥; serial number: 1110102015; MFG_NAME01: FENGHUA; MFG_PN01: RC-01000JT; PCB Footprint: R0201; Value: 0R
R3036 = R0402,4.7K_Dup1: 0201,0Ohm,+/-5%; Part Reference: R3036; precision: ¡À1£¥; serial number: 1110102015; MFG_PN01: RC-01000JT; MFG_NAME01: FENGHUA; PCB Footprint: R0201; Value: 0R
R3039 = R0402,4.7K_Dup1: 0201,0Ohm,+/-5%; Part Reference: R3039; precision: ¡À1£¥; serial number: 1110102015; MFG_PN01: RC-01000JT; MFG_NAME01: FENGHUA; PCB Footprint: R0201; Value: 0R
R3040 = RES: 0201,100Ohm,+/-1%; Part Reference: R3040; CLASS: DISCRETE; FPLIST: RC0402_25,RC0402_HD,RC0402_X2,0402_CC; CAD_APPROVED: Yes; Temp Range: -55¡ãC to +175¡ãC; MFG_NAME01: FENGHUA; MFG_PN01: RC-01W1000FT; Value: 100R; PCB Footprint: R0201; HEIGHT: 0.45MM; ROHS: Yes
R3041 = RESISTOR5: 0201,100K,+/-1%; Part Reference: R3041; Manufacturer: YAGEO; Manufacturer PN: RC0402JR-07100KL; Tolerance: 5%; MFG_PN01: RC-01W1003FT; RK PN: 901001447; Priority: A; Wattage: 1/16W; MFG_NAME01: FENGHUA; PCB Footprint: R0201; Value: 100K; Part Type: Í¨ÓÃºñÄ¤µç×è; Created by: YTL
R3044 = RES: 0201,100Ohm,+/-1%; Part Reference: R3044; CLASS: DISCRETE; MFG_PN01: RC-01W1000FT; MFG_NAME01: FENGHUA; Temp Range: -55¡ãC to +175¡ãC; CAD_APPROVED: Yes; FPLIST: RC0402_25,RC0402_HD,RC0402_X2,0402_CC; Value: 100R; PCB Footprint: R0201; ROHS: Yes; HEIGHT: 0.45MM
R3053 = RES: 0201,100Ohm,+/-1%; Part Reference: R3053; CLASS: DISCRETE; MFG_PN01: RC-01W1000FT; MFG_NAME01: FENGHUA; Temp Range: -55¡ãC to +175¡ãC; CAD_APPROVED: Yes; FPLIST: RC0402_25,RC0402_HD,RC0402_X2,0402_CC; Value: 100R; PCB Footprint: R0201; ROHS: Yes; HEIGHT: 0.45MM
R3054 = RES: 0201,100Ohm,+/-1%; Part Reference: R3054; CLASS: DISCRETE; MFG_PN01: RC-01W1000FT; MFG_NAME01: FENGHUA; Temp Range: -55¡ãC to +175¡ãC; CAD_APPROVED: Yes; FPLIST: RC0402_25,RC0402_HD,RC0402_X2,0402_CC; Value: 100R; PCB Footprint: R0201; ROHS: Yes; HEIGHT: 0.45MM
R3057 = RES: 0201,10K,+/-5%; Part Reference: R3057; CLASS: DISCRETE; FPLIST: RC0402_25,RC0402_HD,0402_CC; CAD_APPROVED: Yes; MFG_PN01: RC-01W103JT; MFG_NAME01: FENGHUA; Value: 10K; PCB Footprint: R0201; HEIGHT: 0.4 MM; ROHS: Yes
R3058 = RES: 0201,10K,+/-5%; Part Reference: R3058; CLASS: DISCRETE; FPLIST: RC0402_25,RC0402_HD,0402_CC; CAD_APPROVED: Yes; MFG_PN01: RC-01W103JT; MFG_NAME01: FENGHUA; Value: 10K; PCB Footprint: R0201; HEIGHT: 0.4 MM; ROHS: Yes
TP1049 = T POINT R: no part to order; Part Reference: TP1049; ASSY_OPT: DNP; CLASS: IC; MFG_PN01: NOT A COMPONENT; CAD_APPROVED: Yes; PCB Footprint: tpad_020; MFG_NAME01: NOT A COMPONENT; ROHS: Yes; HEIGHT: 0.1MM
TP1050 = T POINT R: no part to order; Part Reference: TP1050; ASSY_OPT: DNP; CLASS: IC; MFG_PN01: NOT A COMPONENT; CAD_APPROVED: Yes; PCB Footprint: tpad_020; MFG_NAME01: NOT A COMPONENT; ROHS: Yes; HEIGHT: 0.1MM
TP1051 = T POINT R: no part to order; Part Reference: TP1051; ASSY_OPT: DNP; CLASS: IC; MFG_PN01: NOT A COMPONENT; CAD_APPROVED: Yes; PCB Footprint: tpad_020; MFG_NAME01: NOT A COMPONENT; ROHS: Yes; HEIGHT: 0.1MM
TP1052 = T POINT R: no part to order; Part Reference: TP1052; ASSY_OPT: DNP; CLASS: IC; CAD_APPROVED: Yes; MFG_NAME01: NOT A COMPONENT; PCB Footprint: tpad_020; HEIGHT: 0.1MM; ROHS: Yes; MFG_PN01: NOT A COMPONENT
TP1053 = T POINT R: no part to order; Part Reference: TP1053; ASSY_OPT: DNP; CLASS: IC; MFG_PN01: NOT A COMPONENT; CAD_APPROVED: Yes; PCB Footprint: tpad_020; MFG_NAME01: NOT A COMPONENT; ROHS: Yes; HEIGHT: 0.1MM
TP1054 = T POINT R: no part to order; Part Reference: TP1054; ASSY_OPT: DNP; CLASS: IC; MFG_PN01: NOT A COMPONENT; CAD_APPROVED: Yes; PCB Footprint: tpad_020; MFG_NAME01: NOT A COMPONENT; ROHS: Yes; HEIGHT: 0.1MM
TP1055 = T POINT R: no part to order; Part Reference: TP1055; ASSY_OPT: DNP; CLASS: IC; MFG_PN01: NOT A COMPONENT; CAD_APPROVED: Yes; PCB Footprint: tpad_020; MFG_NAME01: NOT A COMPONENT; ROHS: Yes; HEIGHT: 0.1MM
TP1056 = T POINT R: no part to order; Part Reference: TP1056; ASSY_OPT: DNP; CLASS: IC; MFG_PN01: NOT A COMPONENT; CAD_APPROVED: Yes; PCB Footprint: tpad_020; MFG_NAME01: NOT A COMPONENT; ROHS: Yes; HEIGHT: 0.1MM
TP1057 = T POINT R: no part to order; Part Reference: TP1057; ASSY_OPT: DNP; CLASS: IC; CAD_APPROVED: Yes; MFG_NAME01: NOT A COMPONENT; PCB Footprint: tpad_020; HEIGHT: 0.1MM; ROHS: Yes; MFG_PN01: NOT A COMPONENT
TP1058 = T POINT R: no part to order; Part Reference: TP1058; ASSY_OPT: DNP; CLASS: IC; MFG_PN01: NOT A COMPONENT; CAD_APPROVED: Yes; PCB Footprint: tpad_020; MFG_NAME01: NOT A COMPONENT; ROHS: Yes; HEIGHT: 0.1MM
TP1059 = T POINT R: no part to order; Part Reference: TP1059; ASSY_OPT: DNP; CLASS: IC; CAD_APPROVED: Yes; MFG_NAME01: NOT A COMPONENT; PCB Footprint: tpad_020; HEIGHT: 0.1MM; ROHS: Yes; MFG_PN01: NOT A COMPONENT
TP1060 = T POINT R: no part to order; Part Reference: TP1060; ASSY_OPT: DNP; CLASS: IC; CAD_APPROVED: Yes; MFG_NAME01: NOT A COMPONENT; PCB Footprint: tpad_020; HEIGHT: 0.1MM; ROHS: Yes; MFG_PN01: NOT A COMPONENT
TP1061 = T POINT R: no part to order; Part Reference: TP1061; ASSY_OPT: DNP; CLASS: IC; CAD_APPROVED: Yes; MFG_NAME01: NOT A COMPONENT; PCB Footprint: tpad_020; HEIGHT: 0.1MM; ROHS: Yes; MFG_PN01: NOT A COMPONENT
TP1062 = T POINT R: no part to order; Part Reference: TP1062; ASSY_OPT: DNP; CLASS: IC; CAD_APPROVED: Yes; MFG_NAME01: NOT A COMPONENT; PCB Footprint: tpad_020; HEIGHT: 0.1MM; ROHS: Yes; MFG_PN01: NOT A COMPONENT
TP1063 = T POINT R: no part to order; Part Reference: TP1063; ASSY_OPT: DNP; CLASS: IC; MFG_PN01: NOT A COMPONENT; CAD_APPROVED: Yes; MFG_NAME01: NOT A COMPONENT; ROHS: Yes; HEIGHT: 0.1MM; PCB Footprint: tpad_020
TP1064 = T POINT R: no part to order; Part Reference: TP1064; ASSY_OPT: DNP; CLASS: IC; MFG_PN01: NOT A COMPONENT; CAD_APPROVED: Yes; MFG_NAME01: NOT A COMPONENT; ROHS: Yes; HEIGHT: 0.1MM; PCB Footprint: tpad_020
TP1065 = T POINT R: no part to order; Part Reference: TP1065; ASSY_OPT: DNP; CLASS: IC; CAD_APPROVED: Yes; MFG_NAME01: NOT A COMPONENT; HEIGHT: 0.1MM; ROHS: Yes; MFG_PN01: NOT A COMPONENT; PCB Footprint: tpad_020
TP1066 = T POINT R: no part to order; Part Reference: TP1066; ASSY_OPT: DNP; CLASS: IC; CAD_APPROVED: Yes; MFG_NAME01: NOT A COMPONENT; HEIGHT: 0.1MM; ROHS: Yes; MFG_PN01: NOT A COMPONENT; PCB Footprint: tpad_020
TP1067 = T POINT R: no part to order; Part Reference: TP1067; ASSY_OPT: DNP; CLASS: IC; MFG_PN01: NOT A COMPONENT; CAD_APPROVED: Yes; PCB Footprint: tpad_020; MFG_NAME01: NOT A COMPONENT; ROHS: Yes; HEIGHT: 0.1MM
TP1068 = T POINT R: no part to order; Part Reference: TP1068; ASSY_OPT: DNP; CLASS: IC; MFG_PN01: NOT A COMPONENT; CAD_APPROVED: Yes; PCB Footprint: tpad_020; MFG_NAME01: NOT A COMPONENT; ROHS: Yes; HEIGHT: 0.1MM
TP1069 = T POINT R: no part to order; Part Reference: TP1069; ASSY_OPT: DNP; CLASS: IC; MFG_PN01: NOT A COMPONENT; CAD_APPROVED: Yes; PCB Footprint: tpad_020; MFG_NAME01: NOT A COMPONENT; ROHS: Yes; HEIGHT: 0.1MM
TP1070 = T POINT R: no part to order; Part Reference: TP1070; ASSY_OPT: DNP; CLASS: IC; MFG_PN01: NOT A COMPONENT; CAD_APPROVED: Yes; PCB Footprint: tpad_020; MFG_NAME01: NOT A COMPONENT; ROHS: Yes; HEIGHT: 0.1MM
TP1071 = T POINT R: no part to order; Part Reference: TP1071; ASSY_OPT: DNP; CLASS: IC; MFG_PN01: NOT A COMPONENT; CAD_APPROVED: Yes; PCB Footprint: tpad_020; MFG_NAME01: NOT A COMPONENT; ROHS: Yes; HEIGHT: 0.1MM
TP1072 = T POINT R: no part to order; Part Reference: TP1072; ASSY_OPT: DNP; CLASS: IC; MFG_PN01: NOT A COMPONENT; CAD_APPROVED: Yes; PCB Footprint: tpad_020; MFG_NAME01: NOT A COMPONENT; ROHS: Yes; HEIGHT: 0.1MM
TP1073 = T POINT R: no part to order; Part Reference: TP1073; ASSY_OPT: DNP; CLASS: IC; MFG_PN01: NOT A COMPONENT; CAD_APPROVED: Yes; PCB Footprint: tpad_020; MFG_NAME01: NOT A COMPONENT; ROHS: Yes; HEIGHT: 0.1MM
TP1074 = T POINT R: no part to order; Part Reference: TP1074; ASSY_OPT: DNP; CLASS: IC; MFG_PN01: NOT A COMPONENT; CAD_APPROVED: Yes; PCB Footprint: tpad_020; MFG_NAME01: NOT A COMPONENT; ROHS: Yes; HEIGHT: 0.1MM
TP1075 = T POINT R: no part to order; Part Reference: TP1075; ASSY_OPT: DNP; CLASS: IC; MFG_PN01: NOT A COMPONENT; CAD_APPROVED: Yes; PCB Footprint: tpad_020; MFG_NAME01: NOT A COMPONENT; ROHS: Yes; HEIGHT: 0.1MM
TP1076 = T POINT R: no part to order; Part Reference: TP1076; ASSY_OPT: DNP; CLASS: IC; MFG_PN01: NOT A COMPONENT; CAD_APPROVED: Yes; PCB Footprint: tpad_020; MFG_NAME01: NOT A COMPONENT; ROHS: Yes; HEIGHT: 0.1MM
TP1077 = T POINT R: no part to order; Part Reference: TP1077; ASSY_OPT: DNP; CLASS: IC; CAD_APPROVED: Yes; MFG_NAME01: NOT A COMPONENT; PCB Footprint: tpad_020; HEIGHT: 0.1MM; ROHS: Yes; MFG_PN01: NOT A COMPONENT
TP1078 = T POINT R: no part to order; Part Reference: TP1078; ASSY_OPT: DNP; CLASS: IC; MFG_PN01: NOT A COMPONENT; CAD_APPROVED: Yes; PCB Footprint: tpad_020; MFG_NAME01: NOT A COMPONENT; ROHS: Yes; HEIGHT: 0.1MM
U723 = MP1605C: MP1605GTF,SOT563; Part Reference: U723; MFG_NAME01: MPS; Value: MP1605C; PCB Footprint: SOT563; MFG_PN01: MP1605GTF
U724 = NLSX5011_0: NLSX5011MUTCG,UDFN6,1.2*1.0,0.4P,One 100Mb/s configurable dual power level converter; Part Reference: U724; CLASS: IC; CAD_APPROVED: Yes; VOLTAGE: 0.9-4.5V; Temp Range: -55¡ãC to +125¡ãC; MFG_NAME01: ON Semiconductor; 3D_Mechanical_Footprint_File: ftp://fcl.am.freescale.net/ALLEGRO/step/udfn6_0p4_1p2x1.STEP; Value: NLSX5011MUTCG; PCB Footprint: udfn6_0p4_1p2x1; Package Size: 1.2x1x0.55 mm; HEIGHT: 0.55MM; ROHS: Yes; MFG_PN01: NLSX5011MUTCG
U725 = PCAL6524HE_QFN: PCAL6524HEAZ,QFN32; Part Reference: U725; CLASS: IC; CAD_APPROVED: Yes; VOLTAGE: 0.8-3.6V/1.65-5.5; Temp Range: -40C to +85C; MFG_NAME01: NXP SEMICONDUCTORS; 3D_Mechanical_Footprint_File: ftp://fcl.am.freescale.net/ALLEGRO/step/uqfn32_0p5_5x5_ep3x3.step; Value: PCAL6524HEAZ; PCB Footprint: uqfn32_0p5_5x5_ep3x3; HEIGHT: 0.6MM; ROHS: Yes; MFG_PN01: PCAL6524HEAZ
U743 = 74AUP1G07GW: 74AUP1G07GW,TSSOP5,1.2*2mm,Low-power buffer with open-drain output; Part Reference: U743; CLASS: IC; MFG_NAME01: TI; VOLTAGE: 0.8-3.6V; CAD_APPROVED: Yes; Value: 74AUP1G07GW; PCB Footprint: sc70-5; MFG_PN01: 74AUP1G07GW; ROHS: Yes; HEIGHT: 1.1MM